# Altium schematic sheet test.SchDoc
size A
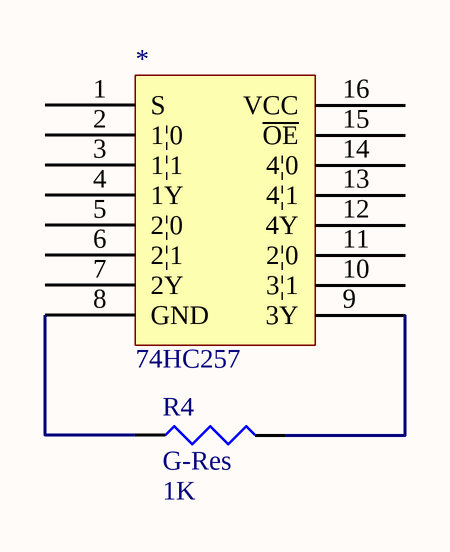
[diagram p0: test.SchDoc]

## Parts
*  74HC257  [DIP16_LGE1.0]
R4  G-Res  value 1K  [Res10mm_LGE1.0]

## Nets
Net*_8: *.8(GND) R4.1
Net*_9: *.9(3Y) R4.2

Not connected (* = marked no-connect by the designer): * 1(S) 2(1|0) 3(1|1) 4(1Y) 5(2|0) 6(2|1) 7(2Y) 10(3|1) 11(2|0) 12(4Y) 13(4|1) 14(4|0) 15(~{OE}) 16(VCC)

## Library data of the parts
R4 = G-Res: resistor (specify value); Published: 8-Jun-2000; LatestRevisionDate: 29-May-2009; LatestRevisionNote: IPC-7351 Footprint Added.; PackageReference: J1-0603; Publisher: Altium Limited; PackageDescription: Chip Resistor